# EasyEDA schematic Drop Screen OCT 2022 Drivers_1.json
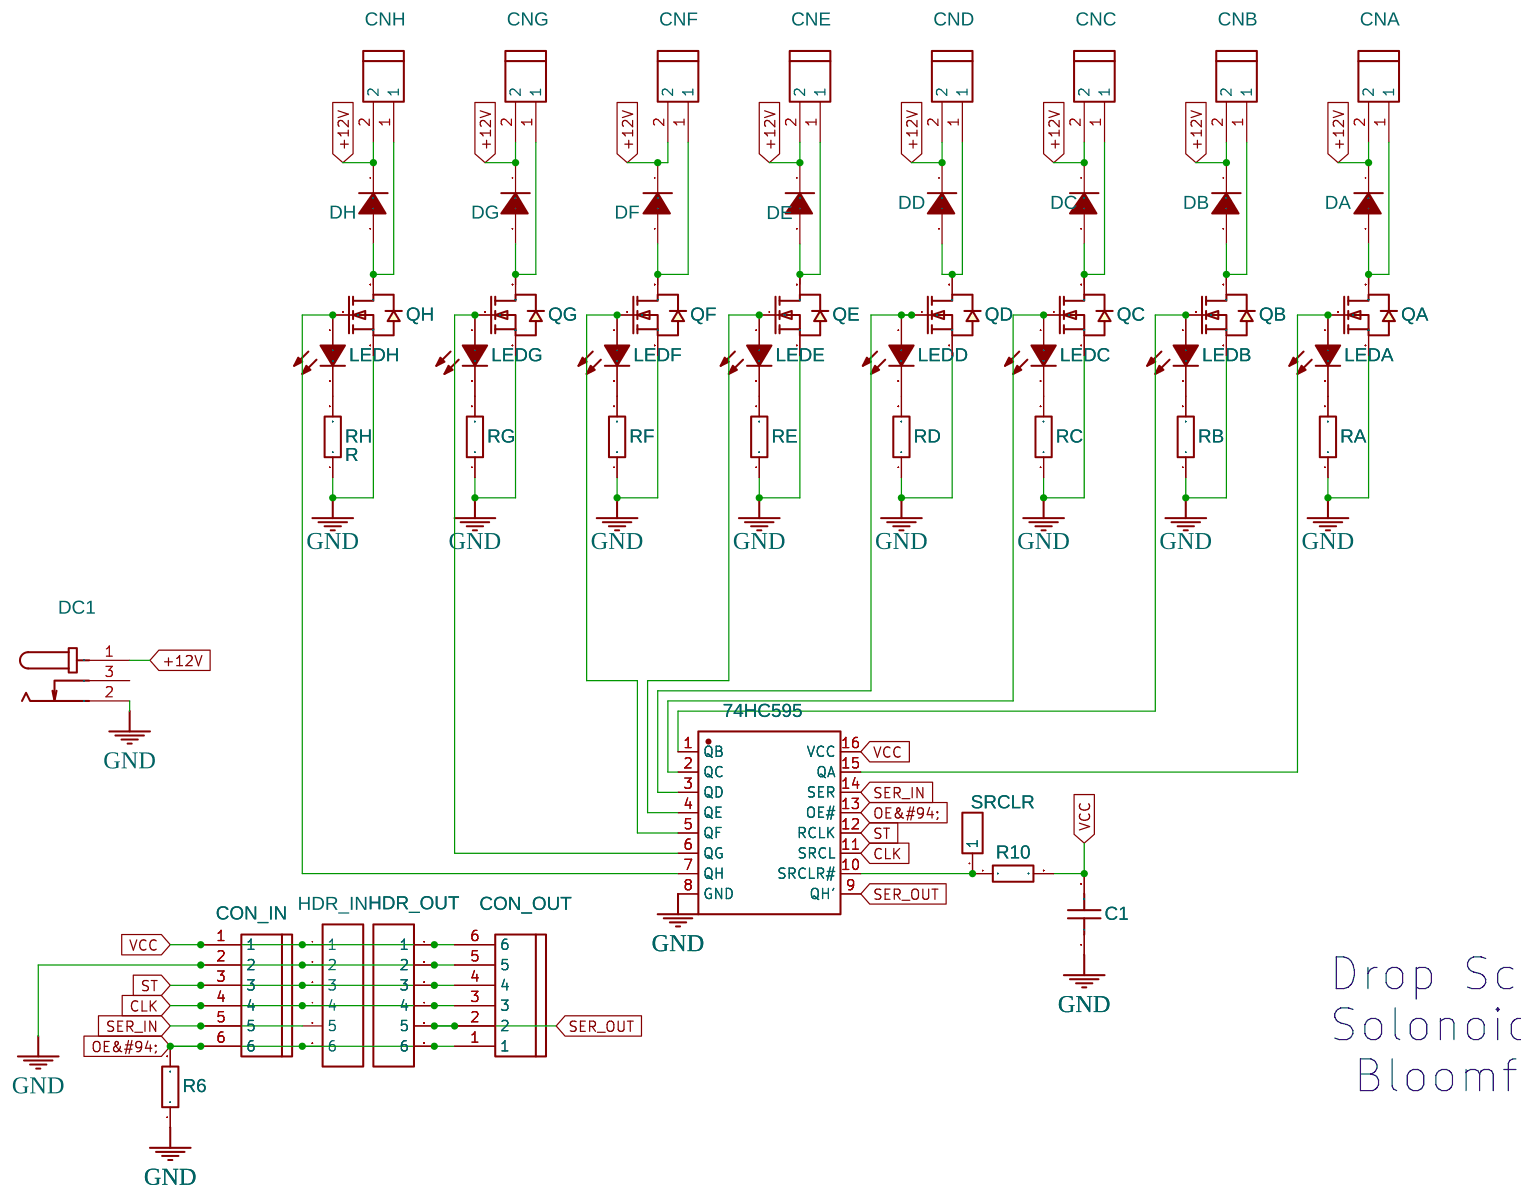
[diagram p0: schematic sheet]

## Parts
C1  C  [C0603]
CNA  CON  [CONN-TH_2P-P2.50_XH-2AW]
CNB  CON  [CONN-TH_2P-P2.50_XH-2AW]
CNC  CON  [CONN-TH_2P-P2.50_XH-2AW]
CND  CON  [CONN-TH_2P-P2.50_XH-2AW]
CNE  CON  [CONN-TH_2P-P2.50_XH-2AW]
CNF  CON  [CONN-TH_2P-P2.50_XH-2AW]
CNG  CON  [CONN-TH_2P-P2.50_XH-2AW]
CNH  CON  [CONN-TH_2P-P2.50_XH-2AW]
CON_IN  CON6  [CONN-TH_XH-6AW]
CON_OUT  CON6  [CONN-TH_XH-6AW]
DA  D  [SMAF_L3.5-W2.6-LS4.7-RD]
DB  D  [SMAF_L3.5-W2.6-LS4.7-RD]
DC  D  [SMAF_L3.5-W2.6-LS4.7-RD]
DC1  DC  [DC-IN-TH_DC005]
DD  D  [SMAF_L3.5-W2.6-LS4.7-RD]
DE  D  [SMAF_L3.5-W2.6-LS4.7-RD]
DF  D  [SMAF_L3.5-W2.6-LS4.7-RD]
DG  D  [SMAF_L3.5-W2.6-LS4.7-RD]
DH  D  [SMAF_L3.5-W2.6-LS4.7-RD]
HDR_IN  HDR6  [HDR-M-2.54_1X6]
HDR_OUT  HDR6  [HDR-M-2.54_1X6]
IC2  74HC595  [SOP-16_L10.0-W3.9-P1.27-LS6.0-BL]
LEDA  LED  [LED0603-R-RD_BLUE]
LEDB  LED  [LED0603-R-RD_BLUE]
LEDC  LED  [LED0603-R-RD_BLUE]
LEDD  LED  [LED0603-R-RD_BLUE]
LEDE  LED  [LED0603-R-RD_BLUE]
LEDF  LED  [LED0603-R-RD_BLUE]
LEDG  LED  [LED0603-R-RD_BLUE]
LEDH  LED  [LED0603-R-RD_BLUE]
QA  Q  [SOT-23-3_L2.9-W1.3-P1.90-LS2.4-BR]
QB  Q  [SOT-23-3_L2.9-W1.3-P1.90-LS2.4-BR]
QC  Q  [SOT-23-3_L2.9-W1.3-P1.90-LS2.4-BR]
QD  Q  [SOT-23-3_L2.9-W1.3-P1.90-LS2.4-BR]
QE  Q  [SOT-23-3_L2.9-W1.3-P1.90-LS2.4-BR]
QF  Q  [SOT-23-3_L2.9-W1.3-P1.90-LS2.4-BR]
QG  Q  [SOT-23-3_L2.9-W1.3-P1.90-LS2.4-BR]
QH  Q  [SOT-23-3_L2.9-W1.3-P1.90-LS2.4-BR]
R6  R  [R0603]
R10  R  [R0603]
RA  R  [R0603]
RB  R  [R0603]
RC  R  [R0603]
RD  R  [R0603]
RE  R  [R0603]
RF  R  [R0603]
RG  R  [R0603]
RH  R  [R0603]
SRCLR  HDR-M-2.54_1x1  [HDR-M-2.54_1X1]

## Library data of the parts
C1 = CC0603KRX7R7BB104: Supplier: LCSC; Supplier Part: C108079; Manufacturer: YAGEO(国巨); Contributor: LCSC; JLCPCB Part Class: Extended Part; Package Display: No
CNA CNB CNC CND CNE CNF CNG CNH = XH-2AW: Supplier: LCSC; Manufacturer: BOOMELE; Supplier Part: C33132; JLCPCB Part Class: Extended Part; Package Display: No
CON_IN CON_OUT = XH-6AW_C8876: Supplier: LCSC; Manufacturer: BOOMELE; Manufacturer Part: XH-6AW; Supplier Part: C8876; JLCPCB Part Class: Extended Part
DA DB DC DD DE DF DG DH = 1N4007F: Supplier: LCSC; Manufacturer: SK; Supplier Part: C110856; JLCPCB Part Class: Extended Part; Package Display: No
DC1 = DC005-2.0MM: Supplier: LCSC; Manufacturer: SOFNG; Supplier Part: C111567; Package Display: No
HDR_IN HDR_OUT = HDR-M-2.54_1x6: Supplier Part: C190819; Supplier: LCSC; Contributor: LCEDA_Lib; Package Display: No
IC2 = U74HC595AG-S16-R: Supplier: LCSC; Manufacturer: UTC; Supplier Part: C87300; JLCPCB Part Class: Extended Part; Package Display: No
LEDA LEDB LEDC LEDD LEDE LEDF LEDG LEDH = 19-217/BHC-ZL1M2RY/3T: Supplier: LCSC; Manufacturer: EVERLIGHT; Supplier Part: C72041; JLCPCB Part Class: Basic Part; Package Display: No
QA QB QC QD QE QF QG QH = JSM2302: Supplier: LCSC; Supplier Part: C916403; Manufacturer: JSMSEMI; Contributor: LCSC; JLCPCB Part Class: Extended Part; Package Display: No
R6 R10 RA RB RC RD RE RF RG RH = 0603WAF1001T5E: Supplier: LCSC; Manufacturer: UniOhm; Supplier Part: C21190; Resistance (Ohms): 1K; JLCPCB Part Class: Basic Part; Package Display: No
SRCLR = HDR-M-2.54_1x1: Supplier Part: C81276; Supplier: LCSC; Contributor: LCEDA_Lib; Package Display: No

## Nets
+12V: CNA.2 CNB.2 CNC.2 CND.2 CNE.2 CNF.2 CNG.2 CNH.2 DA.1(C) DB.1(C) DC.1(C) DC1.1 DD.1(C) DE.1(C) DF.1(C) DG.1(C) DH.1(C)
GND: C1.1 CON_IN.2 CON_OUT.5 DC1.2 HDR_IN.2 HDR_OUT.2 IC2.8(GND) QA.2(S) QB.2(S) QC.2(S) QD.2(S) QE.2(S) QF.2(S) QG.2(S) QH.2(S) R6.1 RA.1 RB.1 RC.1 RD.1 RE.1 RF.1 RG.1 RH.1
VCC: C1.2 CON_IN.1 CON_OUT.6 HDR_IN.1 HDR_OUT.1 IC2.16(VCC) R10.2
CLK: CON_IN.4 CON_OUT.3 HDR_IN.4 HDR_OUT.4 IC2.11(SRCL)
OE&#94;: CON_IN.6 CON_OUT.1 HDR_IN.6 HDR_OUT.6 IC2.13(OE#) R6.2
SER_IN: CON_IN.5 HDR_IN.5 IC2.14(SER)
SER_OUT: CON_OUT.2 HDR_OUT.5 IC2.9(QH')
ST: CON_IN.3 CON_OUT.4 HDR_IN.3 HDR_OUT.3 IC2.12(RCLK)
Net-(CNA-1): CNA.1 DA.2(A) QA.3(D)
Net-(CNB-1): CNB.1 DB.2(A) QB.3(D)
Net-(CNC-1): CNC.1 DC.2(A) QC.3(D)
Net-(CND-1): CND.1 DD.2(A) QD.3(D)
Net-(CNE-1): CNE.1 DE.2(A) QE.3(D)
Net-(CNF-1): CNF.1 DF.2(A) QF.3(D)
Net-(CNG-1): CNG.1 DG.2(A) QG.3(D)
Net-(CNH-1): CNH.1 DH.2(A) QH.3(D)
Net-(IC2-1): IC2.1(QB) LEDB.1(A) QB.1(G)
Net-(IC2-2): IC2.2(QC) LEDC.1(A) QC.1(G)
Net-(IC2-3): IC2.3(QD) LEDD.1(A) QD.1(G)
Net-(IC2-4): IC2.4(QE) LEDE.1(A) QE.1(G)
Net-(IC2-5): IC2.5(QF) LEDF.1(A) QF.1(G)
Net-(IC2-6): IC2.6(QG) LEDG.1(A) QG.1(G)
Net-(IC2-7): IC2.7(QH) LEDH.1(A) QH.1(G)
Net-(IC2-10): IC2.10(SRCLR#) R10.1 SRCLR.1
Net-(IC2-15): IC2.15(QA) LEDA.1(A) QA.1(G)
Net-(LEDA-2): LEDA.2(C) RA.2
Net-(LEDB-2): LEDB.2(C) RB.2
Net-(LEDC-2): LEDC.2(C) RC.2
Net-(LEDD-2): LEDD.2(C) RD.2
Net-(LEDE-2): LEDE.2(C) RE.2
Net-(LEDF-2): LEDF.2(C) RF.2
Net-(LEDG-2): LEDG.2(C) RG.2
Net-(LEDH-2): LEDH.2(C) RH.2

Not connected (* = marked no-connect by the designer): DC1 3

## Notes on the sheet
- Drop Screen OCT 2022,
  Solonoid Driver
   Bloomfield Science Museum .
